# EasyEDA schematic 1-Schematic_Compact-256-Turbo.json
TITLE: Compact 256 Turbo; REV: 1.1r; Date: 2020-08-04; Sheet: 1/1; Drawn By: romychs_4693; Company: zx-pk.ru
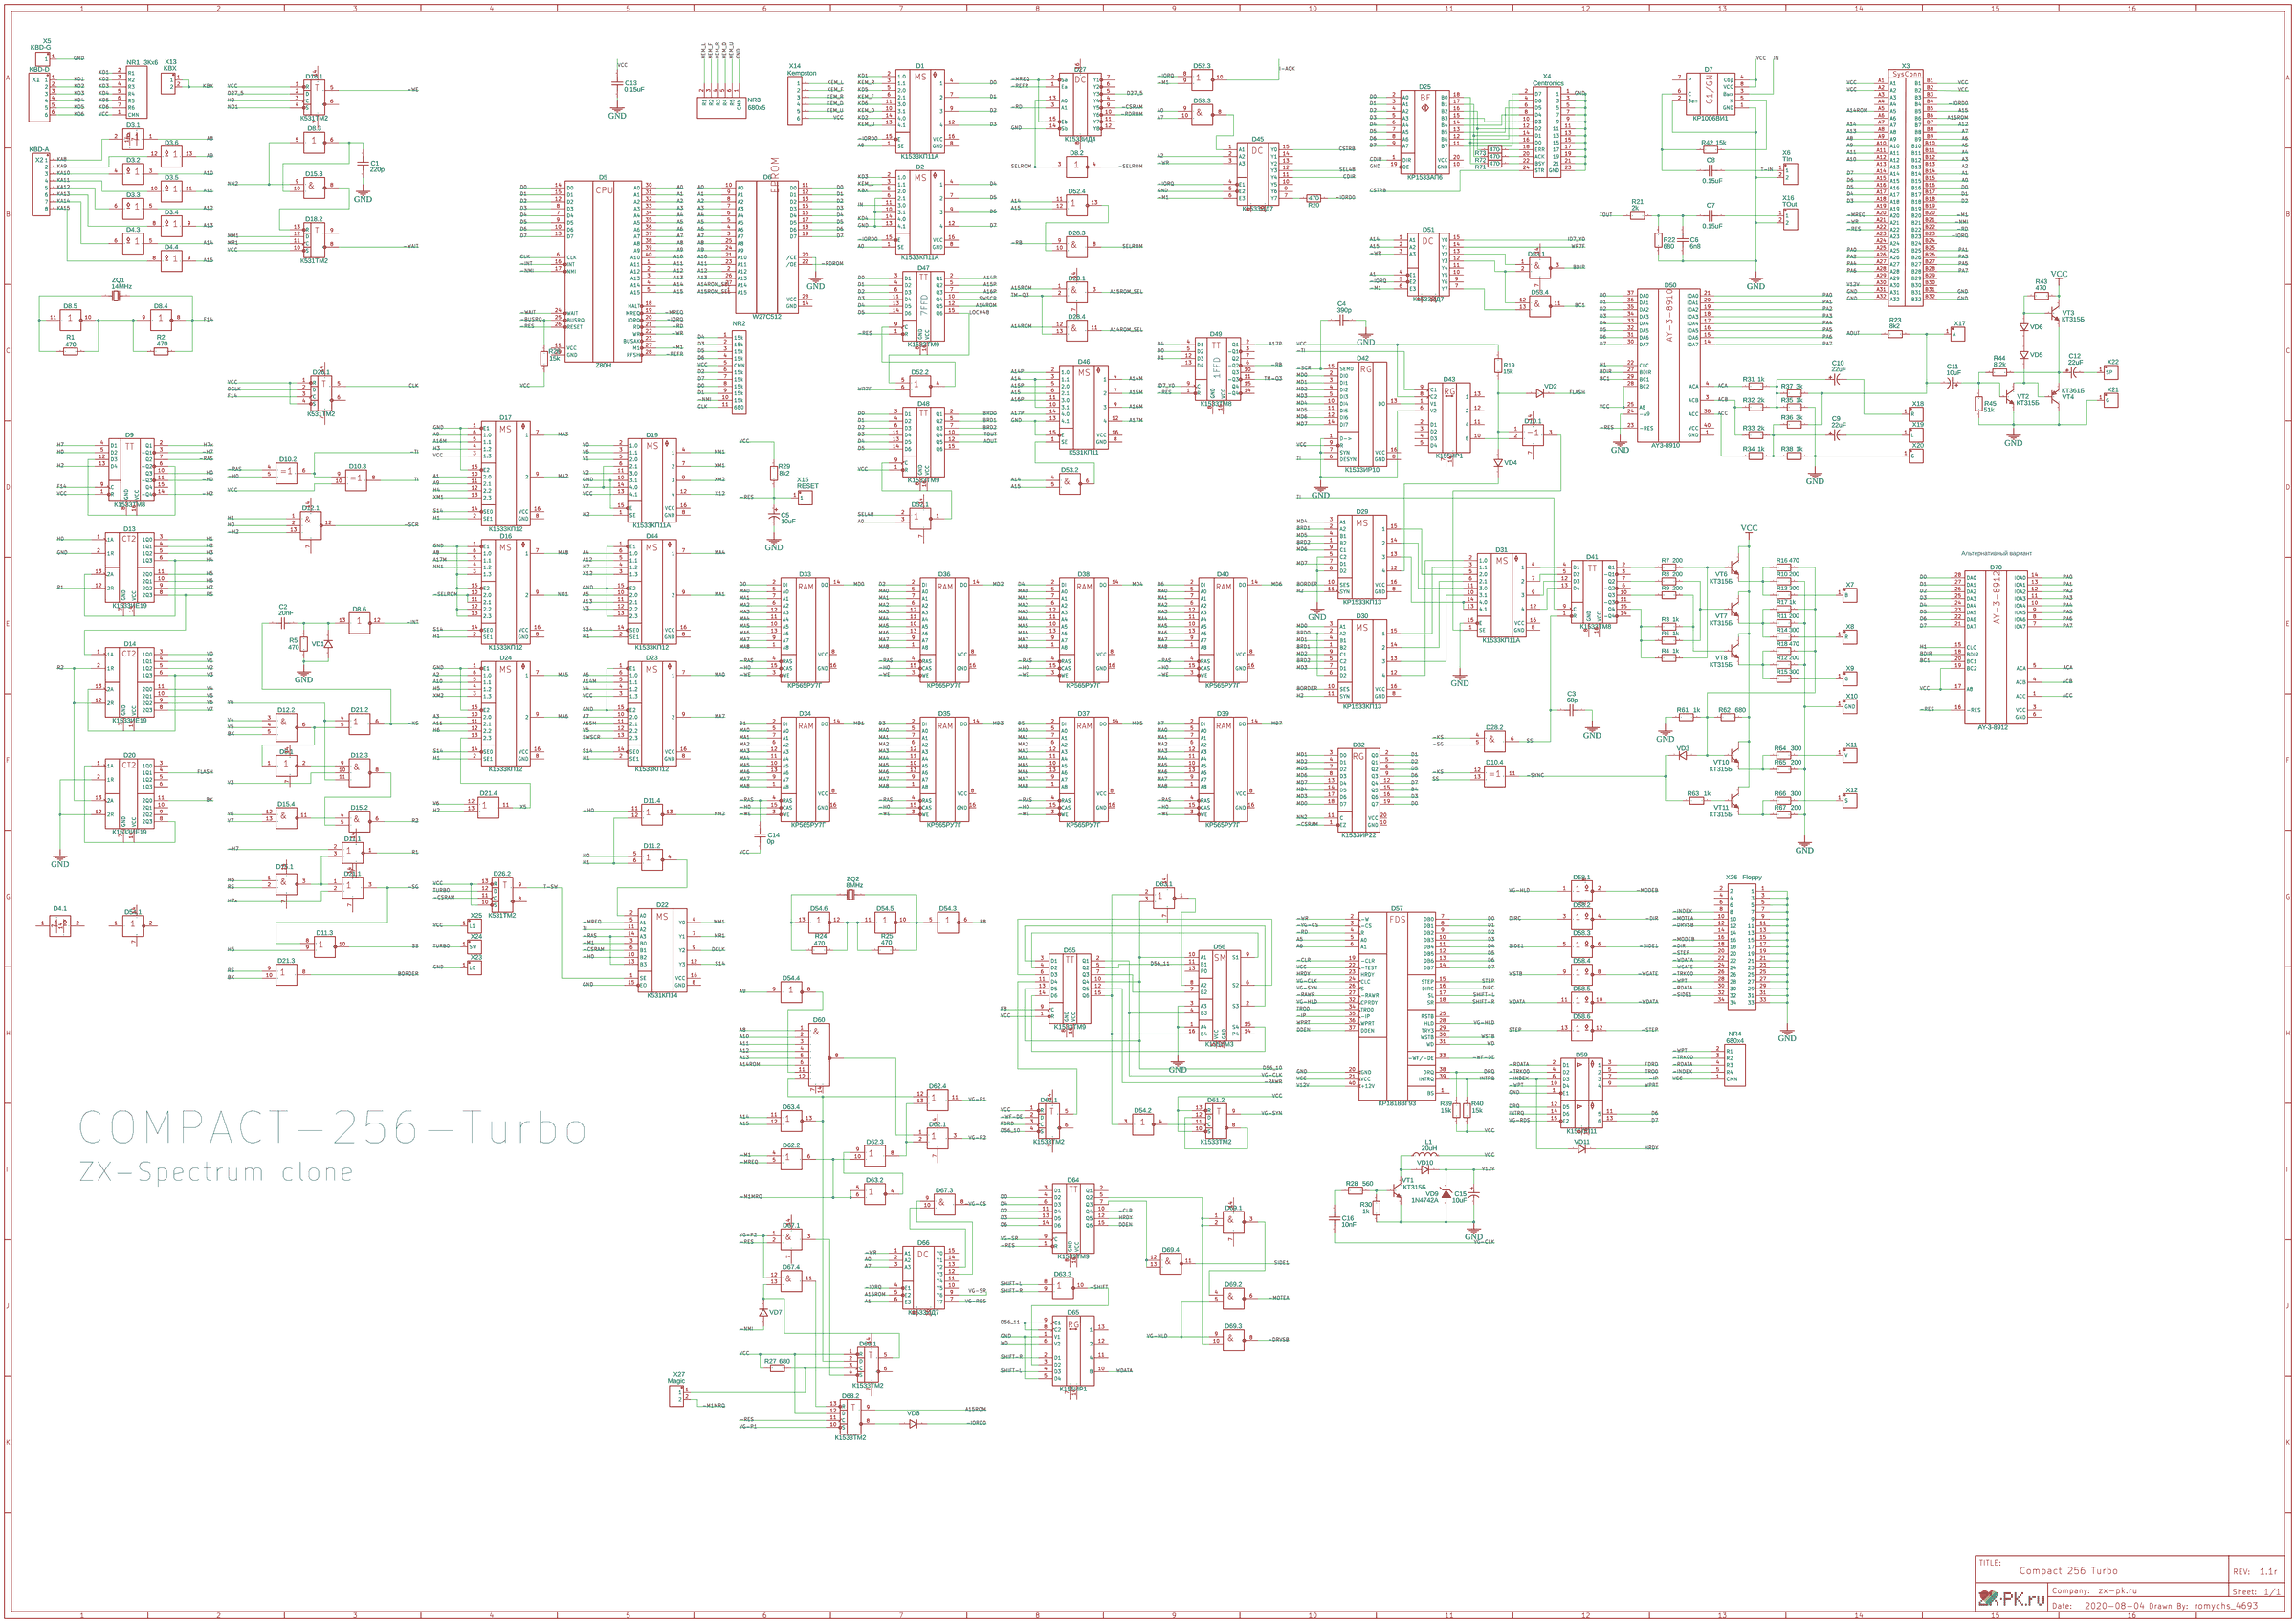
[diagram p0: schematic sheet]

## Parts
C1  220p  [CAP-TH_L7.0-W3.0-P5.00-D0.9]
C2  20nF  [CAP-TH_L7.0-W3.0-P5.00-D0.9]
C3  68p  [CAP-TH_L7.0-W3.0-P5.00-D0.9]
C4  390p  [CAP-TH_L7.0-W3.0-P5.00-D0.9]
C5  10uF  [CAP-TH_BD6.3-P2.50-D1.0-FD]
C6  6n8  [CAP-TH_L7.0-W3.0-P5.00-D0.9]
C7  0.15uF  [CAP-TH_L7.0-W3.0-P5.00-D0.9]
C8  0.15uF  [CAP-TH_L7.0-W3.0-P5.00-D0.9]
C9  22uF  [CAP-TH_BD6.3-P2.50-D1.0-FD]
C10  22uF  [CAP-TH_BD6.3-P2.50-D1.0-FD]
C11  10uF  [CAP-TH_BD6.3-P2.50-D1.0-FD]
C12  22uF  [CAP-TH_BD6.3-P2.50-D1.0-FD]
C13  0.15uF  [CAP_TH_7.62]
C14  0p  [CAP_TH_3.68]
C15  10uF  [CAP-TH_BD6.3-P2.50-D1.0-FD]
C16  10nF  [CAP-TH_L3.8-W2.5-P2.50-D0.51]
D1  К1533КП11A  [DIP-16_L19.8-W6.5-P2.54-LS7.6-BL]
D2  К1533КП11A  [DIP-16_L19.8-W6.5-P2.54-LS7.6-BL]
D3  К155ЛП9  [DIP-14_L20.0-W7.6-P2.54-LS7.6-BL]  (sections 1,2,3,4,5,6)
D4  К155ЛП9  [DIP-14_L20.0-W7.6-P2.54-LS7.6-BL]  (sections 1,3,4)
D5  Z80H  [DIP-40_L50.8-W17.8-P2.54-LS15.2-BL]
D6  W27C512  [DIP-28_L35.6-W17.8-P2.54-LS15.2-BL]
D7  КР1006ВИ1  [DIP-8_L11.0-W7.6-P2.54-LS7.6-BL]
D8  К1533ЛН1  [DIP-14_L20.0-W7.6-P2.54-LS8.0-BL]  (sections 1,2,3,4,5,6)
D9  К1533ТМ8  [DIP-16_L19.8-W6.5-P2.54-LS7.6-BL]
D10  К1533ЛП5  [DIP-14_L20.0-W7.6-P2.54-LS8.0-BL]  (sections 1,2,3,4)
D11  К1533ЛЕ1  [DIP-14_L20.0-W7.6-P2.54-LS8.0-BL]  (sections 1,2,3,4)
D12  К1533ЛА4  [DIP-14_L20.0-W7.6-P2.54-LS8.0-BL]  (sections 1,2,3)
D13  К1533ИЕ19  [DIP-14_L20.0-W7.6-P2.54-LS8.0-BL]
D14  К1533ИЕ19  [DIP-14_L20.0-W7.6-P2.54-LS8.0-BL]
D15  К1533ЛА3  [DIP-14_L20.0-W7.6-P2.54-LS8.0-BL]  (sections 1,2,3,4)
D16  К1533КП12  [DIP-16_L19.8-W6.5-P2.54-LS7.6-BL]
D17  К1533КП12  [DIP-16_L19.8-W6.5-P2.54-LS7.6-BL]
D18  К531ТМ2  [DIP-14_L20.0-W7.6-P2.54-LS8.0-BL]  (sections 1,2)
D19  К1533КП11A  [DIP-16_L19.8-W6.5-P2.54-LS7.6-BL]
D20  К1533ИЕ19  [DIP-14_L20.0-W7.6-P2.54-LS8.0-BL]
D21  К1533ЛЛ1  [DIP-14_L20.0-W7.6-P2.54-LS8.0-BL]  (sections 1,2,3,4)
D22  К531КП14  [DIP-16_L20.4-W5.8-P2.54-LS7.6-BL]
D23  К1533КП12  [DIP-16_L19.8-W6.5-P2.54-LS7.6-BL]
D24  К1533КП12  [DIP-16_L19.8-W6.5-P2.54-LS7.6-BL]
D25  КР1533АП6  [DIP-20_L25.4-W7.1-P2.54-LS8.5-BL]
D26  К531ТМ2  [DIP-14_L20.0-W7.6-P2.54-LS8.0-BL]  (sections 1,2)
D27  К1533ИД4  [DIP-16_L20.4-W5.8-P2.54-LS7.6-BL]
D28  К1533ЛИ1  [DIP-14_L20.0-W7.6-P2.54-LS8.0-BL]  (sections 1,2,3,4)
D29  КР1533КП13  [DIP-16_L20.4-W5.8-P2.54-LS7.6-BL]
D30  КР1533КП13  [DIP-16_L20.4-W5.8-P2.54-LS7.6-BL]
D31  К1533КП11A  [DIP-16_L19.8-W6.5-P2.54-LS7.6-BL]
D32  К1533ИР22  [DIP-20_L25.4-W7.1-P2.54-LS8.5-BL]
D33  КР565РУ7Г  [DIP-16_L19.8-W6.5-P2.54-LS7.6-BL]
D34  КР565РУ7Г  [DIP-16_L19.8-W6.5-P2.54-LS7.6-BL]
D35  КР565РУ7Г  [DIP-16_L19.8-W6.5-P2.54-LS7.6-BL]
D36  КР565РУ7Г  [DIP-16_L19.8-W6.5-P2.54-LS7.6-BL]
D37  КР565РУ7Г  [DIP-16_L19.8-W6.5-P2.54-LS7.6-BL]
D38  КР565РУ7Г  [DIP-16_L19.8-W6.5-P2.54-LS7.6-BL]
D39  КР565РУ7Г  [DIP-16_L19.8-W6.5-P2.54-LS7.6-BL]
D40  КР565РУ7Г  [DIP-16_L19.8-W6.5-P2.54-LS7.6-BL]
D41  К1533ТМ8  [PDIP-16_L19.7-W6.6-P2.54-LS10.9-BL]
D42  К1533ИР10  [DIP-16_L20.4-W5.8-P2.54-LS7.6-BL]
D43  К155ИР1  [DIP-14_L20.0-W7.6-P2.54-LS8.0-BL]
D44  К1533КП12  [DIP-16_L19.8-W6.5-P2.54-LS7.6-BL]
D45  К1533ИД7  [DIP-16_L19.8-W6.5-P2.54-LS7.6-BL]
D46  К531КП11  [DIP-16_L19.8-W6.5-P2.54-LS7.6-BL]
D47  K1533TM9  [PDIP-16_L19.7-W6.6-P2.54-LS10.9-BL]
D48  K1533TM9  [PDIP-16_L19.7-W6.6-P2.54-LS10.9-BL]
D49  К1533ТМ8  [PDIP-16_L19.7-W6.6-P2.54-LS10.9-BL]
D50  AY3-8910  [DIP-40_L50.8-W17.8-P2.54-LS15.2-BL]
D51  К1533ИД7  [DIP-16_L19.8-W6.5-P2.54-LS7.6-BL]
D52  К1533ЛЕ1  [DIP-14_L20.0-W7.6-P2.54-LS8.0-BL]  (sections 1,2,3,4)
D53  К1533ЛА3  [DIP-14_L20.0-W7.6-P2.54-LS8.0-BL]  (sections 1,2,3,4)
D54  К1533ЛН1  [DIP-14_L20.0-W7.6-P2.54-LS8.0-BL]  (sections 1,2,3,4,5,6)
D55  K1533TM9  [DIP-16_L19.8-W6.5-P2.54-LS7.6-BL]
D56  К155ИМ3  [DIP-16_L19.8-W6.5-P2.54-LS7.6-BL]
D57  КР1818ВГ93  [DIP-40_L50.8-W17.8-P2.54-LS15.2-BL]
D58  К1533ЛН3  [DIP-14_L20.0-W7.6-P2.54-LS8.0-BL]  (sections 1,2,3,4,5,6)
D59  К155ЛП11  [DIP-16_L19.8-W6.5-P2.54-LS7.6-BL]
D60  К1533ЛА2  [DIP-14_L20.0-W7.6-P2.54-LS8.0-BL]
D61  К1533ТМ2  [DIP-14_L20.0-W7.6-P2.54-LS8.0-BL]  (sections 1,2)
D62  К1533ЛЛ1  [DIP-14_L20.0-W7.6-P2.54-LS8.0-BL]  (sections 1,2,3,4)
D63  К1533ЛЕ1  [DIP-14_L20.0-W7.6-P2.54-LS8.0-BL]  (sections 1,2,3,4)
D64  K1533TM9  [PDIP-16_L19.7-W6.6-P2.54-LS10.9-BL]
D65  К155ИР1  [DIP-14_L20.0-W7.6-P2.54-LS8.0-BL]
D66  К1533ИД7  [DIP-16_L19.8-W6.5-P2.54-LS7.6-BL]
D67  К555ЛИ1  [DIP-14_L20.0-W7.6-P2.54-LS8.0-BL]  (sections 1,3,4)
D68  К1533ТМ2  [DIP-14_L20.0-W7.6-P2.54-LS8.0-BL]  (sections 1,2)
D69  К1533ЛА3  [DIP-14_L20.0-W7.6-P2.54-LS8.0-BL]  (sections 1,2,3,4)
D70  AY-3-8912  [PDIP-28_L38.1-W12.7-P2.54-LS15.3-BL]
L1  20uH  [L_TH_17.78]
NR1  3Кx6  [HDR-TH_7P-P2.54-V-M]
NR2  НР-11-C256T  [HDR-TH_11P-P2.54-V_A2541HWV-11P]
NR3  680x5  [HDR-TH_6P-P2.54-V-M]
NR4  680x4  [HDR-TH_5P-P2.54-V-M]
R1  470  [R_0.125_7.62]
R2  470  [R_0.125_7.62]
R3  1k  [R_0.25_10.16]
R4  1k  [R_0.25_10.16]
R5  470  [R_0.125_7.62]
R6  1k  [R_0.25_10.16]
R7  200  [R_0.25_10.16]
R8  200  [R_0.25_10.16]
R9  200  [R_0.25_10.16]
R10  200  [R_0.25_10.16]
R11  200  [R_0.25_10.16]
R12  200  [R_0.25_10.16]
R13  300  [R_0.25_10.16]
R14  300  [R_0.25_10.16]
R15  300  [R_0.25_10.16]
R16  470  [R_0.25_10.16]
R17  1k  [R_0.25_10.16]
R18  470  [R_0.25_10.16]
R19  15k  [R_0.25_10.16]
R20  470  [R_0.25_10.16]
R21  2k  [R_0.25_10.16]
R22  680  [R_0.25_10.16]
R23  8k2  [R_0.25_10.16]
R24  470  [R_0.125_7.62]
R25  470  [R_0.125_7.62]
R26  15k  [R_0.125_7.62]
R27  680  [R_0.125_V_TH]
R28  560  [R_0.125_7.62]
R29  8k2  [R_0.25_10.16]
R30  1k  [R_0.25_10.16]
R31  1k  [R_0.125_V_TH]
R32  2k  [R_0.125_V_TH]
R33  2k  [R_0.125_V_TH]
R34  1k  [R_0.125_V_TH]
R35  1k  [R_0.125_V_TH]
R36  3k  [R_0.125_V_TH]
R37  3k  [R_0.125_V_TH]
R38  1k  [R_0.125_V_TH]
R39  15k  [R_0.125_7.62]
R40  15k  [R_0.125_7.62]
R42  15k  [R_0.125_7.62]
R43  470  [R_0.125_V_TH]
R44  8.2k  [R_0.125_V_TH]
R45  51k  [R_0.125_V_TH]
R61  1k  [R_0.25_10.16]
R62  680  [R_0.25_10.16]
R63  1k  [R_0.25_10.16]
R64  300  [R_0.25_10.16]
R65  200  [R_0.25_10.16]
R66  300  [R_0.25_10.16]
R67  200  [R_0.25_10.16]
R71  470  [R_0.25_10.16]
R72  470  [R_0.25_10.16]
R73  470  [R_0.25_10.16]
VD1  1N4148  [D_TH_7.62]
VD2  1N4148  [D_TH_7.62]
VD3  1N4148  [D_TH_7.62]
VD4  1N4148  [D_TH_7.62]
VD5  1N4148  [D_TH_2.54_V]
VD6  1N4148  [D_TH_2.54_V]
VD7  1N4148  [D_TH_7.62]
VD8  1N4148  [D_TH_7.62]
VD9  1N4742A  [D_TH_15.24]
VD10  1N4148  [D_TH_7.62]
VD11  1N4148  [D_TH_7.62]
VT1  КТ315Б  [TO-92-3_L4.8-W3.7-P2.54-L]
VT2  КТ315Б  [TO-92-3_L4.8-W3.7-P2.54-L]
VT3  КТ315Б  [TO-92-3_L4.8-W3.7-P2.54-L]
VT4  КТ361Б  [TO-92-3_L4.8-W3.7-P2.54-L]
VT6  КТ315Б  [TO-92-3_L4.8-W3.7-P2.54-L]
VT7  КТ315Б  [TO-92-3_L4.8-W3.7-P2.54-L]
VT8  КТ315Б  [TO-92-3_L4.8-W3.7-P2.54-L]
VT10  КТ315Б  [TO-92-3_L4.8-W3.7-P2.54-L]
VT11  КТ315Б  [TO-92-3_L4.8-W3.7-P2.54-L]
X1  KBD-D  [HDR-TH_6P-P2.54-V]
X2  KBD-A  [HDR-TH_8P-P2.54-V-M]
X3  SysExt  [SYS_CONN_32X2]
X4  Centronics  [HDR_24P_12X2_2.5]
X5  KBD-G  [HDR-TH_1P-P2.54-V-M]
X6  TIn  [HDR-TH_2P-P2.54-V]
X7  B  [HDR-TH_1P-P2.54-V-M]
X8  R  [HDR-TH_1P-P2.54-V-M]
X9  G  [HDR-TH_1P-P2.54-V-M]
X10  GND  [HDR-TH_1P-P2.54-V-M]
X11  V  [HDR-TH_1P-P2.54-V-M]
X12  S  [HDR-TH_1P-P2.54-V-M]
X13  KBX  [HDR-TH_2P-P2.54-V]
X14  Kempston  [HDR-TH_6P-P2.54-V-M]
X15  RESET  [HDR-TH_1P-P2.54-V-M]
X16  TOut  [HDR-TH_2P-P2.54-V]
X17  A  [HDR-TH_1P-P2.54-V-M]
X18  R  [HDR-TH_1P-P2.54-V-M]
X19  L  [HDR-TH_1P-P2.54-V-M]
X20  AGND  [HDR-TH_1P-P2.54-V-M]
X21  GND  [HDR-TH_1P-P2.54-V-M]
X22  SPKR  [HDR-TH_1P-P2.54-V-M]
X23  L0  [HDR-TH_1P-P2.54-V-M]
X24  TURBO SW  [HDR-TH_1P-P2.54-V-M]
X25  L1  [HDR-TH_1P-P2.54-V-M]
X26  Floppy  [IDC-TH_Z-231011834106]
X27  Magic  [HDR-TH_2P-P2.54-V]
ZQ1  14MHz  [OSC-49U-1]
ZQ2  8MHz  [OSC-49U-1]

## Library data of the parts
C1-C4 C6-C8 C13 C14 = CK45-R3AD152K-VRY: Supplier: LCSC; Supplier Part: C340608; Manufacturer: TDK; Contributor: LCSC
C5 C9-C12 C15 = ECLJ0612220M101P00: Supplier: LCSC; Supplier Part: C156809; Manufacturer: Guangdong TOPAZ Elec Tech; Contributor: LCSC
C16 = SR155C103KAR: Supplier: LCSC; Supplier Part: C444736; Manufacturer: AVX; Contributor: LCSC
D1 D2 D19 D31 D46 = К1533КП11A: Supplier: chipdip; Contributor: Roman Boykov
D3 D4 = К155ЛП9: Supplier: chipdip; Contributor: Roman Boykov; subpart_no: 1
D5 = Z80H: Supplier: chipdip; Contributor: romychs_4693
D6 = W27C512: Supplier: chipdip; Contributor: Roman Boykov
D7 = КР1006ВИ1: Supplier: chipdip; Contributor: romychs_4693
D8 = К1533ЛН1: Supplier: chipdip; Contributor: Roman Boykov; subpart_no: 2
D9 D41 D49 = К1533ТМ8: Supplier: chipdip; Contributor: Roman Boykov
D10 = К1533ЛП5: Supplier: chipdip; Contributor: Roman Boykov; subpart_no: 1
D11 D52 D63 = К1533ЛЕ1: Supplier: chipdip; Contributor: Roman Boykov; subpart_no: 1
D12 = К1533ЛА4: Supplier: chipdip; Contributor: Roman Boykov; subpart_no: 1
D13 D14 D20 = К1533ИЕ19: Contributor: Roman Boykov
D15 D53 D69 = К1533ЛА3: Supplier: chipdip; Contributor: Roman Boykov; subpart_no: 1
D16 D17 D23 D24 D44 = К1533КП12: Supplier: chipdip; Contributor: romychs_4693
D18 D26 = К531ТМ2: Supplier: chipdip; Contributor: Roman Boykov; subpart_no: 1
D21 D62 = К1533ЛЛ1: Supplier: chipdip; Contributor: Roman Boykov; subpart_no: 1
D22 = К531КП14: Supplier: chipdip; Contributor: romychs_4693
D25 = КР1533АП6: Supplier: chipdip; Contributor: romychs_4693
D27 = К1533ИД4: Supplier: chipdip; Contributor: romychs_4693
D28 D67 = К1533ЛИ1: Supplier: chipdip; Contributor: Roman Boykov; subpart_no: 1
D29 D30 = КР1533КП13: Supplier: chipdip; Contributor: romychs_4693
D32 = К1533ИР22: Supplier: chipdip; link: TTL; Регистр; ИР22; Contributor: Roman Boykov
D33-D40 = КР565РУ7Г: Supplier: chipdip; Contributor: Roman Boykov
D42 = К1533ИР10: Supplier: chipdip; link: TTL; Регистр; ИР23; Contributor: Roman Boykov
D43 D65 = К155ИР1: Supplier: chipdip; Contributor: romychs_4693
D45 D51 D66 = К1533ИД7: Supplier: chipdip; Contributor: romychs_4693; subpart_no: 4
D47 D48 D55 D64 = K1533TM9: Supplier: chipdip; Contributor: Roman Boykov
D50 = AY3-8910: Supplier: chip-dip; Contributor: Roman Boykov
D54 = К1533ЛН1: Supplier: chipdip; Contributor: Roman Boykov; subpart_no: 11
D56 = К155ИМ3: Contributor: Roman Boykov
D57 = КР1818ВГ93: link: ВГ93; FDD; Contributor: Roman Boykov
D58 = К1533ЛН3: Supplier: chipdip; Contributor: Roman Boykov; subpart_no: 7
D59 = К155ЛП11: Contributor: romychs_4693
D60 = К1533ЛА2: Supplier: chipdip; Contributor: Roman Boykov
D61 D68 = К1533ТМ2: Supplier: chipdip; Contributor: romychs_4693; subpart_no: 3
D70 = AY-3-8912: Supplier: chipdip; Contributor: romychs_4693
L1 = LGA0510-101KP52E: Supplier: LCSC; Manufacturer: FH; Supplier Part: C71328
NR1 = НР-6: Supplier: chipdip; Contributor: Roman Boykov
NR2 = НР-11-C256T: Supplier: chipdip; Contributor: Roman Boykov
NR3 = НР-5: Supplier: chipdip; Contributor: Roman Boykov
NR4 = НР-4: Supplier: chipdip; Contributor: Roman Boykov
R1-R40 R42-R45 R61-R67 R71-R73 = RN 1/8W 470R F T/B A1: Supplier: LCSC; Supplier Part: C433478; Manufacturer: TyoHM; Contributor: LCSC
VD1-VD8 VD10 VD11 = 1N4148: Contributor: EasyEDA
VD9 = 1N4742A: Supplier: LCSC; Manufacturer: Tak Cheong; Supplier Part: C113210
VT1-VT3 VT6-VT8 VT10 VT11 = 2SC1815-TA: Supplier: LCSC; Manufacturer: CJ; image: //image.lceda.cn/szlcsc/C41114.jpg; Supplier Part: C41114
VT4 = 2SA1015-TA: Supplier: LCSC; Supplier Part: C160132; Manufacturer: Changjiang Electronics Tech (CJ); Contributor: LCSC
X1 = 68000-406HLF: Supplier: LCSC; Supplier Part: C178289; Manufacturer: Amphenol ICC; Contributor: LCSC
X2 = Header-Male-2.54_1x8: Supplier: LCSC; Manufacturer: Ckmtw; Manufacturer Part: 210S-1*8P L=11.6MMGold-plated black; Contributor: LCSC; Supplier Part: C124381
X3 = SysConn-32x2: Supplier: chipdip; Contributor: romychs_4693
X4 = Header-24p-12x2: Supplier: chipdip; Contributor: romychs_4693
X5 X15 = 54101-T30-00: Supplier: LCSC; Supplier Part: C213184; Manufacturer: Amphenol ICC; Contributor: LCSC
X6 X13 X16 X27 = 54102-T0600LF: Supplier: LCSC; Supplier Part: C213465; Manufacturer: Amphenol ICC; Contributor: LCSC
X7-X12 X17-X25 = 54102-T06-00: Supplier: LCSC; Supplier Part: C213182; Manufacturer: Amphenol ICC; Contributor: LCSC
X14 = Header-Male-2.54_1x6: Supplier: LCSC; Manufacturer: BOOMELE; Supplier Part: C37208
X26 = Z-231011834106: Supplier: LCSC; Supplier Part: C221069; Manufacturer: Nextronics Engineering; Contributor: LCSC
ZQ1 ZQ2 = X49UD12MSD2SC: Supplier: LCSC; Manufacturer: YXC; Supplier Part: C2188

## Nets
GND: C1.2 C3.1 C4.1 C5.2 C6.2 C13.1 C15.2 D2.6(2.1) D2.10(3.1) D2.13(4.1) D6.20(/CE) D7.1(GND) D7.2(Зап) D13.2(1R) D16.1(E1) D16.3(1.3) D16.12(2.2) D16.13(2.3) D16.15(E2) D17.1(E1) D17.15(E2) D19.10(3.1) D19.15(E) D20.2(1R) D20.12(2R) D22.15(EO) D23.1(E1) D23.15(E2) D24.1(E1) D24.15(E2) D25.19(OE) D27.14(Sb) D29.5(C2) D29.6(D2) D31.15(E) D42.1(D->) D42.7(SYN) D43.6(V2) D44.1(E1) D44.13(2.3) D44.15(E2) D45.5(E2) D46.13(4.1) D46.15(E) D50.24(-A9) D56.1(A4) D56.3(A3) D57.20(GND) D59.1(E1) D65.1(V1) D65.5(D4) NR3.1(CMN) R5.2 R10.2 R11.2 R12.2 R22.1 R30.1 R35.1 R38.1 R45.1 R61.1 R65.2 R67.2 VD1.1(A) VD9.1(A) VT1.1(E) VT2.1(E) VT4.2(C) X3.A31 X3.A32 X3.B31 X3.B32 X4.1 X4.3 X4.5 X4.7 X4.9 X4.11 X4.13 X4.15 X4.17 X4.19 X4.21 X4.23(GND) X5.1 X6.2 X10.1(GND) X16.2 X20.1(G) X21.1(G) X23.1(L0) X26.1 X26.3 X26.5 X26.7 X26.9 X26.11 X26.13 X26.15 X26.17 X26.19 X26.21 X26.23 X26.25 X26.27 X26.29 X26.31 X26.33
V0: D14.3(1Q0) D19.2(1.0)
V1: D14.4(1Q1) D19.5(2.0)
V2: D14.5(1Q2) D19.11(3.0)
V3: D12.10(I2) D14.6(1Q3) D14.13(2A) D44.12(2.2)
V4: D12.3(I1) D14.11(2Q0) D23.4(1.2)
V5: D12.4(I2) D14.10(2Q1) D23.12(2.2)
V6: D12.11(I3) D14.9(2Q2) D15.12(1) D19.3(1.1) D21.4(1) D21.12(1)
V7: D14.8(2Q3) D15.13(2) D19.6(2.1) D19.14(4.0)
V12V: C15.1 D57.40(+12V) VD9.2(K) VD10.2(K) X3.A30
VCC: C13.2 C14.2 D7.4(Сбр) D7.8(VCC) D9.1(R) D10.10(2) D17.3(1.3) D18.1(R) D18.10(S) D19.13(4.1) D23.3(1.3) D26.1(R) D26.4(S) D26.10(S) D26.13(R) D42.9(R) D43.8(C2) D48.1(R) D50.25(A8) D50.28(BC2) D55.1(R) D57.21(VCC) D57.22(-TEST) D61.1(R) D61.10(S) D61.13(R) D68.1(R) D68.12(D) D70.17(A8) D70.19(BC2) L1.2 NR1.1(CMN) NR2.5(CMN) NR4.1(CMN) R19.2 R26.2 R27.2 R29.1 R39.2 R40.1 R43.2 R62.2 VT3.2(C) VT6.2(C) VT7.2(C) VT8.2(C) VT10.2(C) VT11.2(C) X3.A1 X3.A2 X3.B1 X3.B2 X14.6 X25.1(L1)
-BUSRQ: D5.25(BUSRQ) R26.1
-CLR: D57.19(-CLR) D64.10(Q4)
-CSRAM: D22.6(B1) D26.11(С) D27.9(Y5) D32.1(EZ)
-DIR: D58.4(2) X26.18
-DRVSB: D69.8(3) X26.12
-H0: D9.11(-Q3) D10.5(2) D11.11(1) D22.10(B2) D33.15(CAS) D34.15(CAS) D35.15(CAS) D36.15(CAS) D37.15(CAS) D38.15(CAS) D39.15(CAS) D40.15(CAS)
-H2: D9.14(-Q4) D12.13(I3)
-H7: D9.3(-Q1) D11.2(1)
-INDEX: D59.6(D3) NR4.5(R4) VD11.1(A) X26.8
-INT: D5.16(INT) D8.12(2)
-IORD0: D1.15(E) D2.15(E) R20.2 VD8.2(K) X3.B4
-IORQ: D5.20(IORQ) D45.4(E1) D51.5(E2) D52.8(1) D66.4(E1) X3.B23
-IP: D57.35(-IP) D59.7(3)
-KS: C2.2 D10.12(1) D21.6(3) D28.4(1)
-M1: D5.27(M1) D22.3(B0) D45.6(E3) D51.6(E3) D52.9(2) D62.4(1) X3.B20
-M1MRQ: D62.6(3) D62.10(2) D63.5(1) D63.6(2) X27.2
-MODEB: D58.2 X26.16
-MOTEA: D69.6(3) X26.10
-MREQ: D5.19(MREQ) D22.5(A1) D27.2(Sa) D27.15(Eb) D62.5(2) X3.A20
-NMI: D5.17(NMI) NR2.10(15k) VD7.1(A) X3.B21
-RAS: C14.1 D9.7(Q2) D10.4(1) D22.13(B3) D22.14(A3) D33.4(RAS) D34.4(RAS) D35.4(RAS) D36.4(RAS) D37.4(RAS) D38.4(RAS) D39.4(RAS) D40.4(RAS)
-RAWR: D55.12(Q5) D57.27(-RAWR)
-RB: D28.9(1) D49.6(-Q2)
-RD: D5.21(RD) D27.3(A1) D57.4(R) X3.B22
-RDATA: D59.2(D1) NR4.4(R3) X26.30
-RDROM: D6.22(/OE) D27.10(Y6)
-REFR: D5.28(RFSH) D27.1(Ea)
-RES: C5.1 D5.26(RESET) D47.1(R) D49.1(R) D50.23(-RES) D64.1(R) D67.2 D68.11(C) D70.16(-RES) R29.2 X3.A22 X15.1
-SCR: C4.2 D12.12(O) D42.15(SEM0)
-SELROM: D8.4(2) D16.10(2.0) D16.11(2.1)
-SG: D11.8(1) D21.3 D28.5(2)
-SHIFT: D63.10(3) D65.3(D2)
-SIDE1: D58.6(2) X26.32
-STEP: D58.12(2) X26.20
-SYNC: D10.11(3) R63.1 VD3.2(K)
-TI: D10.6(3) D10.9(1) D43.9(C1)
-TRK00: D59.4(D2) NR4.3(R2) X26.26
-VG-CS: D57.3(-CS) D67.8(3)
-WAIT: D5.24(WAIT) D18.8(&#126;Q)
-WDATA: D58.10(2) X26.22
-WE: D18.5(Q) D33.3(WE) D34.3(WE) D35.3(WE) D36.3(WE) D37.3(WE) D38.3(WE) D39.3(WE) D40.3(WE)
-WF-DE: D57.33(-WF/-DE) D61.2(D)
-WGATE: D58.8(2) X26.24
-WPT: D59.10(D4) NR4.2(R1) X26.28
-WR: D5.22(WR) D45.3(A3) D51.3(A3) D57.2(-W) D66.1(A1) X3.A21
A0: D1.1(SE) D2.1(SE) D5.30(A0) D6.10(A0) D17.6(1.0) D52.3(2) D53.9(1) D66.2(A2) X3.B15
A1: D5.31(A1) D6.9(A1) D17.10(2.0) D51.4(E1) D66.6(E3) X3.B14
A2: D5.32(A2) D6.8(A2) D24.6(1.0) D45.2(A2) X3.B13
A3: D5.33(A3) D6.7(A3) D24.10(2.0) X3.B12
A4: D5.34(A4) D6.6(A4) D44.6(1.0) X3.B11
A5: D5.35(A5) D6.5(A5) D44.10(2.0) D57.5(A0) X3.B10
A6: D5.36(A6) D6.4(A6) D23.6(1.0) D57.6(A1) X3.B9
A7: D5.37(A7) D6.3(A7) D23.10(2.0) D53.10(2) D66.3(A3) X3.B8
A8: D3.1 D5.38(A8) D6.25(A8) D16.6(1.0) D60.1 X3.A9
A9: D3.13(1) D5.39(A9) D6.24(A9) D17.11(2.1) D54.9(1) X3.A10
A10: D3.3(1) D5.40(A10) D6.21(A10) D24.5(1.1) D60.2 X3.A12
A11: D3.11(1) D5.1(A11) D6.23(A11) D24.11(2.1) D60.3 X3.A11
A12: D3.5(1) D5.2(A12) D6.2(A12) D44.5(1.1) D60.4 X3.B7
A13: D3.9(1) D5.3(A13) D6.26(A13) D44.11(2.1) D60.5 X3.A8
A14: D4.5(1) D5.4(A14) D46.3(1.1) D46.10(3.1) D51.1(A1) D52.11(1) D53.4(1) D63.11(1) X3.A7
A14M: D23.5(1.1) D46.4(1)
A14P: D46.2(1.0) D47.2(Q1)
A14ROM: D28.12(1) D47.12(Q5) D60.6 X3.A5
A14ROM_SEL: D6.27(A14) D28.11(3)
A15: D4.9(1) D5.5(A15) D46.6(2.1) D51.2(A2) D52.12(2) D53.5(2) D63.12(2) X3.B5
A15M: D23.11(2.1) D46.7(2)
A15P: D46.5(2.0) D47.5(Q2)
A15ROM: D28.1 D66.5(E2) D68.9(Q) X3.B6
A15ROM_SEL: D6.1(A15) D28.3
A16M: D17.5(1.1) D46.9(3)
A16P: D46.11(3.0) D47.7(Q3)
A17M: D16.5(1.1) D46.12(4)
A17P: D46.14(4.0) D49.2(Q1)
ACA: D50.4(ACA) D70.5(ACA) R31.2
ACB: D50.3(ACB) D70.4(ACB) R32.2 R33.2
ACC: D50.38(ACC) D70.1(ACC) R34.2
AOUT: D48.12(Q5) R23.1
BC1: D50.29(BC1) D53.11(3) D70.20(BC1)
BDIR: D50.27(BDIR) D53.3 D70.18(BDIR)
BK: D12.5(I3) D20.11(2Q0) D21.10(2)
BORDER: D21.8(3) D29.10(SES) D30.10(SES)
BRD0: D30.2(A2) D30.6(D2) D48.2(Q1)
BRD1: D29.2(A2) D30.1(B2) D48.5(Q2)
BRD2: D29.1(B2) D30.5(C2) D48.7(Q3)
CDIR: D25.1(DIR) D45.11(Y4)
CLK: D5.6(CLK) D26.5(Q) NR2.11(680)
CSTRB: D45.15(Y0) X4.24(STR)
D0: D1.4(1) D5.14(D0) D6.11(D0) D25.2(A0) D32.19(Q7) D33.2(DI) D47.3(D1) D48.3(D1) D49.5(D2) D50.37(DA0) D57.7(DB0) D64.4(D2) D70.28(DA0) NR2.8(15k) X3.B16
D1: D1.7(2) D5.15(D1) D6.12(D1) D25.3(A1) D32.2(Q0) D34.2(DI) D47.4(D2) D48.4(D2) D49.12(D3) D50.36(DA1) D57.8(DB1) D70.27(DA1) NR2.9(15k) X3.B17
D2: D1.9(3) D5.12(D2) D6.13(D2) D25.4(A2) D32.5(Q1) D36.2(DI) D47.6(D3) D48.6(D3) D50.35(DA2) D57.9(DB2) D64.11(D4) D70.26(DA2) NR2.6(15k) X3.B18
D3: D1.12(4) D5.8(D3) D6.15(D3) D25.5(A3) D32.16(Q6) D35.2(DI) D47.11(D4) D48.11(D4) D50.34(DA3) D57.10(DB3) D64.13(D5) D70.25(DA3) NR2.2(15k) X3.A18
D4: D2.4(1) D5.7(D4) D6.16(D4) D25.6(A4) D32.15(Q5) D38.2(DI) D47.13(D5) D48.13(D5) D49.4(D1) D50.33(DA4) D57.11(DB4) D64.6(D3) D70.24(DA4) NR2.1(15k) X3.A17
D5: D2.7(2) D5.9(D5) D6.17(D5) D25.7(A5) D32.6(Q2) D37.2(DI) D47.14(D6) D48.14(D6) D50.32(DA5) D57.12(DB5) D70.23(DA5) NR2.3(15k) X3.A16
D6: D2.9(3) D5.10(D6) D6.18(D6) D25.8(A6) D32.9(Q3) D40.2(DI) D50.31(DA6) D57.13(DB6) D59.11(5) D64.14(D6) D70.22(DA6) NR2.4(15k) X3.A15
D7: D2.12(4) D5.13(D7) D6.19(D7) D25.9(A7) D32.12(Q4) D39.2(DI) D50.30(DA7) D57.14(DB7) D59.13(6) D70.21(DA7) NR2.7(15k) X3.A14
D27_5: D18.2(D) D27.5(Y3)
D56_10: D55.10(Q4) D55.13(D5) D56.10(A1) D61.4(S) D63.3(2)
D56_11: D55.5(Q2) D56.11(B1) D65.8(C2) D65.9(C1)
DCLK: D22.9(Y2) D26.2(D)
DDEN: D57.37(DDEN) D64.15(Q6)
DIRC: D57.16(DIRC) D58.3(1)
DRQ: D57.38(DRQ) D59.12(D5) R39.1
F8: D54.6(2) D55.9(C)
F14: D8.8(2) D9.9(C) D26.3(С) R2.2 ZQ1.1(OSC1)
FDRD: D59.3(1) D61.3(С)
FLASH: D20.4(1Q1) VD2.2(K)
H0: D9.5(D2) D9.10(Q3) D11.5(1) D12.2(I2) D13.1(1A) D18.3(С)
H1: D11.6(2) D11.12(2) D12.1(I1) D13.3(1Q0) D16.2(SE1) D17.2(SE1) D23.2(SE1) D24.2(SE1) D44.2(SE1) D50.22(CLC) D70.15(CLC)
H2: D9.13(D4) D13.4(1Q1) D19.1(SE) D21.13(2) D29.11(SYN) D30.11(SYN)
H3: D13.5(1Q2) D17.4(1.2)
H4: D13.6(1Q3) D13.13(2A) D17.12(2.2)
H5: D11.9(2) D13.11(2Q0) D24.4(1.2)
H6: D13.10(2Q1) D15.1 D24.12(2.2)
H7: D9.4(D1) D13.9(2Q2) D44.4(1.2)
H7x: D9.2(Q1) D21.2
HRDY: D57.23(HRDY) D64.12(Q5) VD11.2(K)
I-ACK: D52.10(3)
ID7_Y0: D49.9(C) D51.15(Y0)
IN: D2.11(3.0) D7.3(Вых)
INTRQ: D57.39(INTRQ) D59.14(D6) R40.2
KA8: D3.2 X2.1
KA9: D3.12(2) X2.2
KA10: D3.4(2) X2.3
KA11: D3.10(2) X2.4
KA12: D3.6(2) X2.5
KA13: D3.8(2) X2.6
KA14: D4.6(2) X2.7
KA15: D4.8(2) X2.8
KBX: D2.5(2.0) X13.1 X13.2
KD1: D1.2(1.0) NR1.2(R1) X1.1
KD2: D1.14(4.0) NR1.3(R2) X1.2
KD3: D2.2(1.0) NR1.4(R3) X1.3
KD4: D2.14(4.0) NR1.5(R4) X1.4
KD5: D1.5(2.0) NR1.6(R5) X1.5
KD6: D1.11(3.0) NR1.7(R6) X1.6
KEM_D: D1.10(3.1) NR3.5(R4) X14.4
KEM_F: D1.6(2.1) NR3.3(R2) X14.2
KEM_L: D2.3(1.1) NR3.2(R1) X14.1
KEM_R: D1.3(1.1) NR3.4(R3) X14.3
KEM_U: D1.13(4.1) NR3.6(R5) X14.5
LOCK48: D47.15(Q6) D52.5(1)
MA0: D23.7(1) D33.5(A0) D34.5(A0) D35.5(A0) D36.5(A0) D37.5(A0) D38.5(A0) D39.5(A0) D40.5(A0)
MA1: D33.7(A1) D34.7(A1) D35.7(A1) D36.7(A1) D37.7(A1) D38.7(A1) D39.7(A1) D40.7(A1) D44.9(2)
MA2: D17.9(2) D33.6(A2) D34.6(A2) D35.6(A2) D36.6(A2) D37.6(A2) D38.6(A2) D39.6(A2) D40.6(A2)
MA3: D17.7(1) D33.12(A3) D34.12(A3) D35.12(A3) D36.12(A3) D37.12(A3) D38.12(A3) D39.12(A3) D40.12(A3)
MA4: D33.11(A4) D34.11(A4) D35.11(A4) D36.11(A4) D37.11(A4) D38.11(A4) D39.11(A4) D40.11(A4) D44.7(1)
MA5: D24.7(1) D33.10(A5) D34.10(A5) D35.10(A5) D36.10(A5) D37.10(A5) D38.10(A5) D39.10(A5) D40.10(A5)
MA6: D24.9(2) D33.13(A6) D34.13(A6) D35.13(A6) D36.13(A6) D37.13(A6) D38.13(A6) D39.13(A6) D40.13(A6)
MA7: D23.9(2) D33.9(A7) D34.9(A7) D35.9(A7) D36.9(A7) D37.9(A7) D38.9(A7) D39.9(A7) D40.9(A7)
MA8: D16.7(1) D33.1(A8) D34.1(A8) D35.1(A8) D36.1(A8) D37.1(A8) D38.1(A8) D39.1(A8) D40.1(A8)
MD0: D30.3(A1) D32.18(D7) D33.14(DO) D42.2(DI0)
MD1: D30.4(B1) D32.3(D0) D34.14(DO) D42.3(DI1)
MD2: D30.9(C1) D32.4(D1) D36.14(DO) D42.4(DI2)
MD3: D30.7(D1) D32.17(D6) D35.14(DO) D42.5(DI3)
MD4: D29.3(A1) D32.14(D5) D38.14(DO) D42.10(DI4)
MD5: D29.4(B1) D32.7(D2) D37.14(DO) D42.11(DI5)
MD6: D29.9(C1) D32.8(D3) D40.14(DO) D42.12(DI6)
MD7: D29.7(D1) D32.13(D4) D39.14(DO) D42.14(DI7)
MM1: D18.12(D) D22.4(Y0)
MR1: D18.11(С) D22.7(Y1)
NN1: D16.4(1.2) D19.4(1)
NN2: D8.5(1) D11.13(3) D15.9(1) D32.11(C)
NO1: D16.9(2) D18.4(S)
PA0: D50.21(IOA0) D70.14(IOA0) X3.A25
PA1: D50.20(IOA1) D70.13(IOA1) X3.B25
PA2: D50.19(IOA2) D70.12(IOA2) X3.A26
PA3: D50.18(IOA3) D70.11(IOA3) X3.B26
PA4: D50.17(IOA4) D70.10(IOA4) X3.A27
PA5: D50.16(IOA5) D70.9(IOA5) X3.B27
PA6: D50.15(IOA6) D70.8(IOA6) X3.A28
PA7: D50.14(IOA7) D70.7(IOA7) X3.B28
R1: D11.1(3) D13.12(2R)
R2: D14.2(1R) D14.12(2R) D15.6(3) D20.13(2A)
RS: D13.8(2Q3) D14.1(1A) D15.2 D21.9(1)
S14: D16.14(SE0) D17.14(SE0) D22.12(Y3) D23.14(SE0) D24.14(SE0) D44.14(SE0)
SEL48: D45.12(Y3) D52.2(1)
SELROM: D8.3(1) D27.13(A0) D28.8(3)
SHIFT-L: D57.17(SL) D63.8(1) D65.4(D3)
SHIFT-R: D57.18(SR) D63.9(2) D65.2(D1)
SIDE1: D58.5(1) D69.11(3)
SS: D10.13(2) D11.10(3)
SSI: C3.2 D28.6(3) D41.1(R)
STEP: D57.15(STEP) D58.13(1)
SWSCR: D23.13(2.3) D47.10(Q4)
T-IN: C8.2 X6.1
T-SW: D22.1(SE) D26.9(Q)
TI: D10.8(3) D22.11(A2) D41.9(C) D42.6(DESYN)
TM-Q3: D28.2 D28.13(2) D49.11(-Q3)
TOUT: D48.10(Q4) R21.1
TRO0: D57.34(TRO0) D59.5(2)
TURBO: D26.12(D) X24.1(SW)
VG-CLK: C16.1 D55.2(Q1) D56.4(B3) D57.24(CLC)
VG-HLD: D57.28(HLD) D57.32(CPRDY) D58.1 D69.5(2) D69.9(1)
VG-P1: D62.11(3) D68.10(S)
VG-P2: D62.3 D67.1 D67.12(1)
VG-RDS: D59.15(E2) D66.7(Y7)
VG-SR: D64.9(C) D66.9(Y6)
VG-SYN: D57.26(S) D61.9(Q)
WD: D57.31(WD) D65.6(V2)
WDATA: D58.11(1) D65.10(8)
WPRT: D57.36(WPRT) D59.9(4)
WR7F: D51.14(Y1) D52.6(2)
WSTB: D57.30(WSTB) D58.9(1)
X5: D21.11(3) D24.13(2.3)
X12: D19.12(4) D44.3(1.3)
XM1: D17.13(2.3) D19.7(2)
XM2: D19.9(3) D24.3(1.3)
Net-(C1-1): C1.1 D8.6(2) D15.10(2)
Net-(C2-1): C2.1 D8.13(1) R5.1 VD1.2(K)
Net-(C6-1): C6.1 C7.1 R21.2 R22.2
Net-(C7-2): C7.2 X16.1
Net-(C8-1): C8.1 D7.6(C) R42.1
Net-(C9-1): C9.1 R33.1 R34.1 R36.2 R38.2
Net-(C9-2): C9.2 X19.1(L)
Net-(C10-1): C10.1 R31.1 R32.1 R35.2 R37.2
Net-(C10-2): C10.2 X18.1(R)
Net-(C11-1): C11.1 R44.2 R45.2 VT2.3(B)
Net-(C11-2): C11.2 R23.2 R36.1 R37.1 X17.1(A)
Net-(C12-1): C12.1 R44.1 VT3.1(E) VT4.1(E)
Net-(C12-2): C12.2 X22.1(SP)
Net-(C16-2): C16.2 R28.1
Net-(D7-5): D7.5(K) R42.2
Net-(D8.1-1): D8.1 D12.6(O) D21.5(2)
Net-(D8.1-2): D8.2 D12.9(I1)
Net-(D8.4-9): D8.9(1) D8.10(2) R1.2 R2.1
Net-(D8.5-11): D8.11(1) R1.1 ZQ1.2(OSC2)
Net-(D9-6): D9.6(-Q2) D9.12(D3)
Net-(D10.1-1): D10.1 R19.1 VD2.1(A) VD4.1(A)
Net-(D10.1-2): D10.2 D43.10(8)
Net-(D10.1-3): D10.3 D31.1(SE)
Net-(D11.1-3): D11.3(2) D15.3 D21.1
Net-(D11.2-4): D11.4(3) D22.2(A0)
Net-(D12.3-8): D12.8(O) D15.5(2)
Net-(D15.2-4): D15.4(1) D15.11(3)
Net-(D15.3-8): D15.8(3) D18.13(R)
Net-(D20-1): D20.1(1A) D20.8(2Q3)
Net-(D25-11): D25.11(B7) X4.2(D7)
Net-(D25-12): D25.12(B6) X4.4(D6)
Net-(D25-13): D25.13(B5) X4.6(D5)
Net-(D25-14): D25.14(B4) X4.8(D4)
Net-(D25-15): D25.15(B3) X4.10(D3)
Net-(D25-16): D25.16(B2) R73.1 X4.12(D2)
Net-(D25-17): D25.17(B1) R72.1 X4.14(D1)
Net-(D25-18): D25.18(B0) R71.1 X4.16(D0)
Net-(D28.3-10): D28.10(2) D52.13(3)
Net-(D29-12): D29.12(4) VD4.2(K)
Net-(D29-13): D29.13(3) D31.13(4.1) D31.14(4.0)
Net-(D29-14): D29.14(2) D31.11(3.0)
Net-(D29-15): D29.15(1) D31.5(2.0)
Net-(D30-12): D30.12(4) D31.2(1.0)
Net-(D30-13): D30.13(3) D31.10(3.1)
Net-(D30-14): D30.14(2) D31.6(2.1)
Net-(D30-15): D30.15(1) D31.3(1.1)
Net-(D31-4): D31.4(1) D41.4(D1)
Net-(D31-7): D31.7(2) D41.5(D2)
Net-(D31-9): D31.9(3) D41.12(D3)
Net-(D31-12): D31.12(4) D41.13(D4)
Net-(D41-2): D41.2(Q1) R7.1
Net-(D41-7): D41.7(Q2) R8.1
Net-(D41-10): D41.10(Q3) R9.1
Net-(D41-15): D41.15(Q4) R3.1 R4.1 R6.1
Net-(D42-13): D42.13(DO) D43.1(V1)
Net-(D45-1): D45.1(A1) D53.8(3)
Net-(D45-7): D45.7(Y7) R20.1
Net-(D46-1): D46.1(SE) D53.6(3)
Net-(D47-9): D47.9(C) D52.4(3)
Net-(D48-9): D48.9(C) D52.1(3)
Net-(D51-7): D51.7(Y7) D53.13(2)
Net-(D51-12): D51.12(Y3) D53.2 D53.12(1)
Net-(D51-13): D51.13(Y2) D53.1
Net-(D54.2-3): D54.3(1) D55.15(Q6) D56.16(B4) D63.2(1)
Net-(D54.2-4): D54.4(2) D61.11(C)
Net-(D54.3-5): D54.5(1) D54.10(2) R25.2 ZQ2.1(OSC1)
Net-(D54.4-8): D54.8(2) D60.11(7)
Net-(D54.5-11): D54.11(1) D54.12(2) R24.2 R25.1
Net-(D54.6-13): D54.13(1) R24.1 ZQ2.2(OSC2)
Net-(D55-3): D55.3(D1) D56.2(S3)
Net-(D55-4): D55.4(D2) D56.9(S1)
Net-(D55-6): D55.6(D3) D56.6(S2)
Net-(D55-7): D55.7(Q3) D56.7(B2)
Net-(D55-11): D55.11(D4) D61.5(Q)
Net-(D55-14): D55.14(D6) D56.15(S4)
Net-(D56-8): D56.8(A2) D63.1(3)
Net-(D60-8): D60.8 D62.1
Net-(D60-12): D60.12(8) D62.12(1) D63.13(3) D68.2(D)
Net-(D61.2-8): D61.8(-Q) D61.12(D)
Net-(D62.1-2): D62.2 D62.8(3) D62.13(2)
Net-(D62.3-9): D62.9(1) D63.4(3)
Net-(D64-5): D64.5(Q2) D69.1 D69.2 D69.10(2)
Net-(D64-7): D64.7(Q3) D69.12(1) D69.13(2)
Net-(D66-12): D66.12(Y3) D67.9(1)
Net-(D66-13): D66.13(Y2) D67.10(2)
Net-(D67.1-3): D67.3 D68.4(S)
Net-(D67.4-11): D67.11(3) D68.13(R)
Net-(D67.4-13): D67.13(2) D68.5(Q) VD7.2(K)
Net-(D68.1-3): D68.3(С) R27.1 X27.1
Net-(D68.2-8): D68.8(-Q) VD8.1(A)
Net-(D69.1-3): D69.3 D69.4(1)
Net-(L1-1): L1.1 VD10.1(A) VT1.2(C)
Net-(R3-2): R3.2 R9.2 VT8.3(B)
Net-(R4-2): R4.2 R7.2 VT6.3(B)
Net-(R6-2): R6.2 R8.2 VT7.3(B)
Net-(R10-1): R10.1 R13.1 R16.1 VT6.1(E)
Net-(R11-1): R11.1 R14.1 R17.1 VT7.1(E)
Net-(R12-1): R12.1 R15.1 R18.1 VT8.1(E)
Net-(R13-2): R13.2 X7.1(B)
Net-(R14-2): R14.2 X8.1(R)
Net-(R15-2): R15.2 X9.1(G)
Net-(R16-2): R16.2 R17.2 R18.2 R61.2 R62.1 VD3.1(A) VT10.3(B)
Net-(R28-2): R28.2 R30.2 VT1.3(B)
Net-(R43-1): R43.1 VD6.1(A) VT3.3(B)
Net-(R63-2): R63.2 VT11.3(B)
Net-(R64-1): R64.1 R65.1 VT10.1(E)
Net-(R64-2): R64.2 X11.1(V)
Net-(R66-1): R66.1 R67.1 VT11.1(E)
Net-(R66-2): R66.2 X12.1(S)
Net-(R71-2): R71.2 X4.22(BSY)
Net-(R72-2): R72.2 X4.20(ACK)
Net-(R73-2): R73.2 X4.18(ERR)
Net-(VD5-1): VD5.1(A) VD6.2(K)
Net-(VD5-2): VD5.2(K) VT2.2(C) VT4.3(B)

Not connected (* = marked no-connect by the designer): D1 8(GND) 16(VCC); D2 8(GND) 16(VCC); D3 7(GND) 14(VCC); D4 1 2 7(GND) 14(VCC); D5 11(VCC) 18(HALT) 23(BUSAK) 29(GND); D6 14(GND) 28(VCC); D7 7(P); D8 7(GND) 14(VCC); D9 8(GND) 15(Q4) 16(VCC); D10 7(GND) 14(VCC); D11 7(GND) 14(VCC); D12 7(GND) 14(VCC); D13 7(GND) 14(VCC); D14 7(GND) 14(VCC); D15 7(GND) 14(VCC); D16 8(GND) 16(VCC); D17 8(GND) 16(VCC); D18 6(&#126;Q) 7(GND) 9(Q) 14(VCC); D19 8(GND) 16(VCC); D20 3(1Q0) 5(1Q2) 6(1Q3) 7(GND) 9(2Q2) 10(2Q1) 14(VCC); D21 7(GND) 14(VCC); D22 8(GND) 16(VCC); D23 8(GND) 16(VCC); D24 8(GND) 16(VCC); D25 10(GND) 20(VCC); D26 6(&#126;Q) 7(GND) 8(&#126;Q) 14(VCC); D27 4(Y4) 6(Y2) 7(Y1) 8(GND) 11(Y7) 12(Y8) 16(VCC); D28 7(GND) 14(VCC); D29 8(GND) 16(VCC); D30 8(GND) 16(VCC); D31 8(GND) 16(VCC); D32 10(GND) 20(VCC); D33 8(VCC) 16(GND); D34 8(VCC) 16(GND); D35 8(VCC) 16(GND); D36 8(VCC) 16(GND); D37 8(VCC) 16(GND); D38 8(VCC) 16(GND); D39 8(VCC) 16(GND); D40 8(VCC) 16(GND); D41 3(-Q1) 6(-Q2) 8(GND) 11(-Q3) 14(-Q4) 16(VCC); D42 8(GND) 16(VCC); D43 2(D1) 3(D2) 4(D3) 5(D4) 7(GND) 11(4) 12(2) 13(1) 14(VCC); D44 8(GND) 16(VCC); D45 8(GND) 9(Y6) 10(Y5) 13(Y2) 14(Y1) 16(VCC); D46 8(GND) 16(VCC); D47 8(GND) 16(VCC); D48 8(GND) 15(Q6) 16(VCC); D49 3(-Q1) 7(Q2) 8(GND) 10(Q3) 13(D4) 14(-Q4) 15(Q4) 16(VCC); D50 1(GND) 40(VCC); D51 8(GND) 9(Y6) 10(Y5) 11(Y4) 16(VCC); D52 7(GND) 14(VCC); D53 7(GND) 14(VCC); D54 1 2 7(GND) 14(VCC); D55 8(GND) 16(VCC); D56 5(VCC) 12(GND) 13(P0) 14(P4); D57 1(BS) 25(RSTB) 29(TRY3); D58 7(GND) 14(VCC); D59 8(GND) 16(VCC); D60 7(GND) 14(VCC); D61 6(&#126;Q) 7(GND) 14(VCC); D62 7(GND) 14(VCC); D63 7(GND) 14(VCC); D64 2(Q1) 3(D1) 8(GND) 16(VCC); D65 7(GND) 11(4) 12(2) 13(1) 14(VCC); D66 8(GND) 10(Y5) 11(Y4) 14(Y1) 15(Y0) 16(VCC); D67 7(GND) 14(VCC); D68 6(&#126;Q) 7(GND) 14(VCC); D69 7(GND) 14(VCC); D70 3(VCC) 6(GND); X3 A3 A4 A6 A13 A19 A23 A24 A29 B3 B19 B24 B29 B30; X26 2 4 6 14 34

## Notes on the sheet
- 7FFD
- 1FFD
- Альтернативный вариант
- COMPACT-256-Turbo
- ZX-Spectrum clone
